# Altium schematic sheet Sheet1.SchDoc
size A4; SheetNumber: 1; SheetTotal: 1
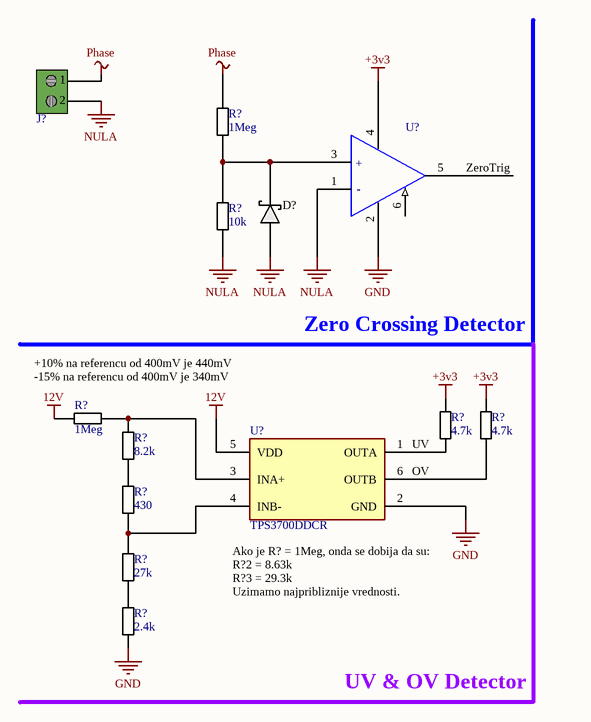
[diagram p0: Sheet1.SchDoc]

## Parts
(Parts that share a designator on the sheet are numbered #1, #2 ... from top to bottom, then left to right.)
D?  SCH_DIODE  [SMA]  (value not drawn)
J?  Wire Terminal Block 2 pin 5mm  [WireTerminalPCB5mm2PIN]  (value not drawn)
R?#1  1Meg  [RESISTOR_0805]
R?#2  10k  [RESISTOR_0805]
R?#3  1Meg  [RESISTOR_0805]
R?#4  4.7k  [RESISTOR_0805]
R?#5  4.7k  [RESISTOR_0805]
R?#6  8.2k  [RESISTOR_0805]
R?#7  430  [RESISTOR_0805]
R?#8  27k  [RESISTOR_0805]
R?#9  2.4k  [RESISTOR_0805]
U?#1  TLV3501AIDBVT  [FP-DBV0006A-MFG]  (value not drawn)
U?#2  TPS3700DDCR  [FP-DDC0006A-IPC_A]

## Nets
12V: R?#3.2 U?#2.5(VDD)
+3v3: R?#4.2 R?#5.2 U?#1.4(V+)
GND: R?#9.1 U?#1.2(V-) U?#2.2(GND)
NULA: D?.1 J?.2 R?#2.1 U?#1.1(-IN)
Phase: J?.1 R?#1.2
OV: R?#5.1 U?#2.6(OUTB)
UV: R?#4.1 U?#2.1(OUTA)
ZeroTrig: U?#1.5(OUT)
NetD?_2: D?.2 R?#1.1 R?#2.2 U?#1.3(+IN)
NetR?#3_1: R?#3.1 R?#6.2 U?#2.3(INA+)
NetR?#6_1: R?#6.1 R?#7.2
NetR?#7_1: R?#7.1 R?#8.2 U?#2.4(INB-)
NetR?#8_1: R?#8.1 R?#9.2

Not connected (* = marked no-connect by the designer): U?#1 6(SHDN)

## Notes on the sheet
- (near R?#3) +10% na referencu od 400mV je 440mV
- Zero Crossing Detector
- (near R?#3) -15% na referencu od 400mV je 340mV
- (near U?#2) Ako je R? = 1Meg, onda se dobija da su:
  R?2 = 8.63k
  R?3 = 29.3k
  Uzimamo najpribliznije vrednosti.
- UV & OV Detector
- (in symbol CMP-04896-000031-1) +; -

## Library data of the parts
J? = Wire Terminal Block 2 pin 5mm: Wire Terminal PCB Block 2 pin 5mm
R?#1 R?#3 = R000007: RES  1Meg OHM 1% 1/8W 0805; resistance: 1Meg
R?#2 = R000005: RES  10k OHM 1% 1/8W 0805; resistance: 10k
R?#4 R?#5 = R000116: RES  4k7 OHM 1% 1/8W 0805; resistance: 4.7k
R?#6 = R000158: RES  8k2 OHM 1% 1/8W 0805; resistance: 8.2k
R?#7 = R000108: RES  430 OHM 1% 1/8W 0805; resistance: 430
R?#8 = R000075: RES  27k OHM 1% 1/8W 0805; resistance: 27k
R?#9 = R000067: RES  2k4 OHM 1% 1/8W 0805; resistance: 2.4k
U?#1 = CMP-04896-000031-1: IC COMP 4.5NS R-R HS SOT23-6; Manufacturer: Texas Instruments; Input Bias Current: 0.000002uA; Input Offset Voltage: 1mV; Number Of Channels: 1; Max Junction Temp: +150°C; Standoff Height: 0mm; Output Current Per Channel: 74mA; Min Supply Voltage: 2.2V; Min Dual Supply Voltage: 1.35V; Max Supply Voltage: 5.5V; Max Dual Supply Voltage: 2.75V; Nominal Supply Current: 3.2mA; Temperature: -40°C to +125°C; Manufacturer Part Number: TLV3501AIDBVT; ComponentLink2URL: https://www.ti.com/lit/ds/symlink/tlv3501.pdf; Ambient Temperature Range Low: -40°C; ComponentLink2Description: Datasheet; Package: DBV0006A; Temperature Range High: +125°C; Mouser Description: Analog Comparators 4.5ns Rail-to-Rail High Speed; RoHS: TRUE; Ambient Temperature Range High: +125°C; Device Class L1: Integrated Circuits (ICs); Device Class L2: Linear ICs; Automotive: No; Height: 1.45mm; Octopart: https://octopart.com/tlv3501aidbvt-texas+instruments-428399; Digikey Description: IC COMP 4.5NS R-R HS SOT23-6; Category: IC; Lead Free: Yes; Device Class L3: Comparators; Temperature Range Low: -40°C
U?#2 = CMP-1708-00001-5: IC COMP WINDOW W/REF 6SOT; Operating Supply Current: 5.5uA; Min Supply Voltage: 1.8V; Nominal Supply Current: 7uA; Number of Voltages Monitored: 2; Max Supply Voltage: 18V; Undervoltage Threshold: 1.7V; Quiescent Current: 11uA; Watchdog Timer: No; Number of Channels: 1; Hysteresis: 5.5mV; Propagation Delay: 29us; REACH SVHC: No SVHC; Case/Package: SOT; Number of Pins: 6; Mount: Surface Mount; Radiation Hardening: No; Max Operating Temperature: 125°C; Package Quantity: 3000; Min Operating Temperature: -40°C; Packaging: Tape and Reel; Number of Elements: 2; Lead Free: Lead Free